# EAGLE design left_revision1_2 (EAGLE 7.2.0)
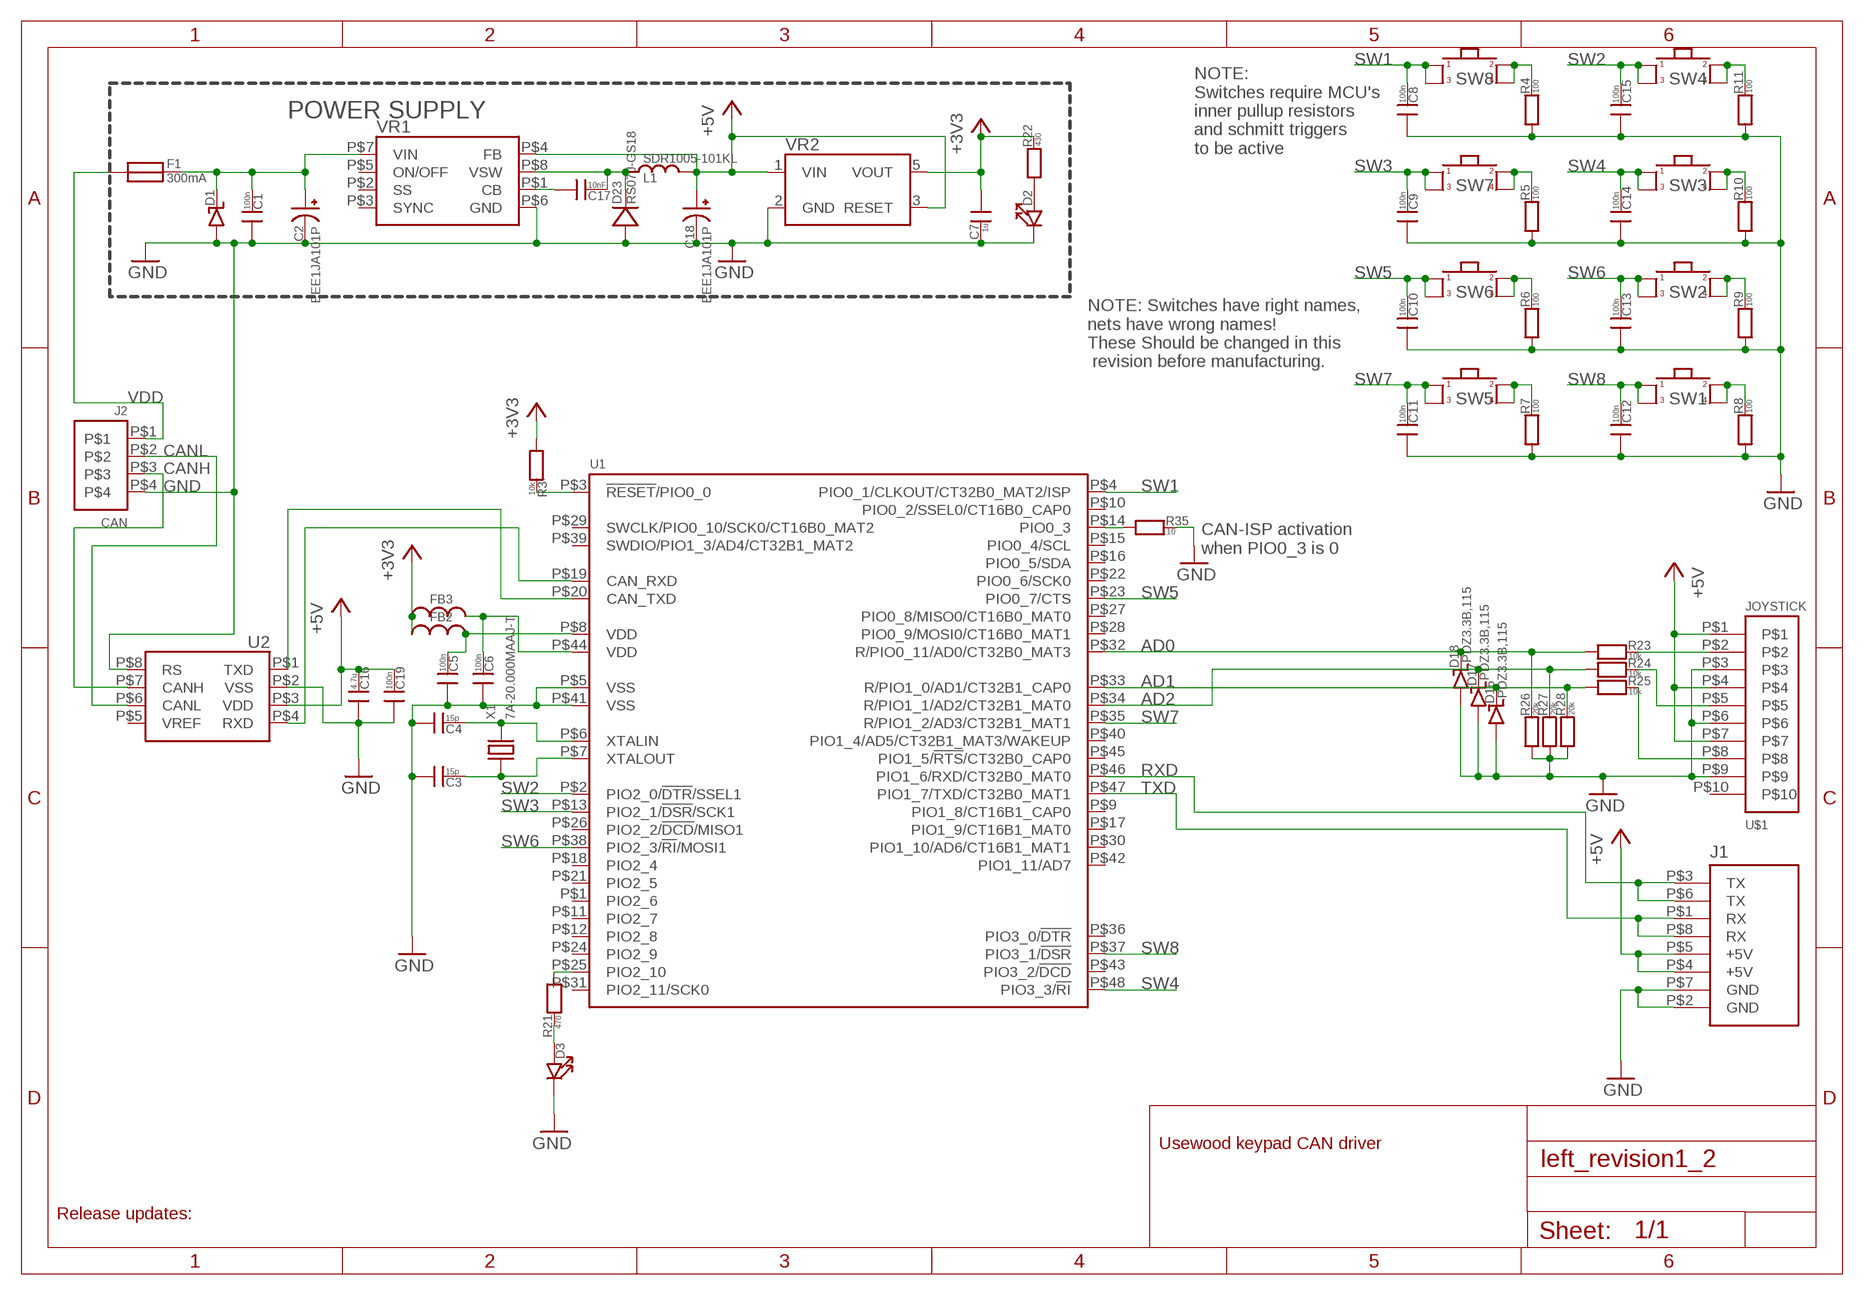
[diagram p0: schematic, sheet 1]

## Parts
C1  100n  CAP0603_SILKSCREEN  [0603_SILKSCREEN]
C2  EEE1JA101P  CAP_POLSMD_10X10X10MM  [CAP_POL_SMD_10X10X10MM]
C3  15p  CAP0603_SILKSCREEN  [0603_SILKSCREEN]
C4  15p  CAP0603_SILKSCREEN  [0603_SILKSCREEN]
C5  100n  CAP0603_SILKSCREEN  [0603_SILKSCREEN]
C6  100n  CAP0603_SILKSCREEN  [0603_SILKSCREEN]
C7  1u  CAP0603_SILKSCREEN  [0603_SILKSCREEN]
C8  100n  CAP0603_SILKSCREEN  [0603_SILKSCREEN]
C9  100n  CAP0603_SILKSCREEN  [0603_SILKSCREEN]
C10  100n  CAP0603_SILKSCREEN  [0603_SILKSCREEN]
C11  100n  CAP0603_SILKSCREEN  [0603_SILKSCREEN]
C12  100n  CAP0603_SILKSCREEN  [0603_SILKSCREEN]
C13  100n  CAP0603_SILKSCREEN  [0603_SILKSCREEN]
C14  100n  CAP0603_SILKSCREEN  [0603_SILKSCREEN]
C15  100n  CAP0603_SILKSCREEN  [0603_SILKSCREEN]
C16  4.7u  CAP0603_SILKSCREEN  [0603_SILKSCREEN]
C17  10nF  CAP0603_SILKSCREEN  [0603_SILKSCREEN]
C18  EEE1JA101P  CAP_POLSMD_10X10X10MM  [CAP_POL_SMD_10X10X10MM]
C19  100n  CAP0603_SILKSCREEN  [0603_SILKSCREEN]
D1  DIODE_TVSDO-214AA  [DO-214AB]
D2  LED0603_SILKSCREEN  [0603_SILKSCREEN]
D3  LED0603_SILKSCREEN  [0603_SILKSCREEN]
D16  PDZ3.3B,115  DIODE_ZENERSDO123  [SOD123]
D17  PDZ3.3B,115  DIODE_ZENERSDO123  [SOD123]
D18  PDZ3.3B,115  DIODE_ZENERSDO123  [SOD123]
D23  RS07J-GS18  DIODEDO219AB  [DO219AB]
F1  300mA  FUSE100MA  [FUSE_100MA]
FB2  FERRITE0603_SILKSCREEN  [0603_SILKSCREEN]
FB3  FERRITE0603_SILKSCREEN  [0603_SILKSCREEN]
J1  HEADER_USART_2_TH  [HEADER_USART_2_TH]
J2  CAN  MOLEX_MICRO-FIT_4WAYTH  [MOLEX_MICRO-FIT_4WAY]
L1  SDR1005-101KL  INDUCTORBOURNS_10X13X5MM  [INDUCTOR_BOURNS_10X13X5MM]
R3  10k  RES0604_SILKSCREEN  [0603_SILKSCREEN]
R4  100  RES0604_SILKSCREEN  [0603_SILKSCREEN]
R5  100  RES0604_SILKSCREEN  [0603_SILKSCREEN]
R6  100  RES0604_SILKSCREEN  [0603_SILKSCREEN]
R7  100  RES0604_SILKSCREEN  [0603_SILKSCREEN]
R8  100  RES0604_SILKSCREEN  [0603_SILKSCREEN]
R9  100  RES0604_SILKSCREEN  [0603_SILKSCREEN]
R10  100  RES0604_SILKSCREEN  [0603_SILKSCREEN]
R11  100  RES0604_SILKSCREEN  [0603_SILKSCREEN]
R21  470  RES0604_SILKSCREEN  [0603_SILKSCREEN]
R22  430  RES0604_SILKSCREEN  [0603_SILKSCREEN]
R23  10k  RES0604_SILKSCREEN  [0603_SILKSCREEN]
R24  10k  RES0604_SILKSCREEN  [0603_SILKSCREEN]
R25  10k  RES0604_SILKSCREEN  [0603_SILKSCREEN]
R26  20k  RES0604_SILKSCREEN  [0603_SILKSCREEN]
R27  20k  RES0604_SILKSCREEN  [0603_SILKSCREEN]
R28  20k  RES0604_SILKSCREEN  [0603_SILKSCREEN]
R35  10  RES0604_SILKSCREEN  [0603_SILKSCREEN]
SW1  SWITCH12X12MM_CENTER_HOLE  [SWITCH_12X12MM_CENTER_HOLE]
SW2  SWITCH12X12MM_CENTER_HOLE  [SWITCH_12X12MM_CENTER_HOLE]
SW3  SWITCH12X12MM_CENTER_HOLE  [SWITCH_12X12MM_CENTER_HOLE]
SW4  SWITCH12X12MM_CENTER_HOLE  [SWITCH_12X12MM_CENTER_HOLE]
SW5  SWITCH12X12MM_CENTER_HOLE  [SWITCH_12X12MM_CENTER_HOLE]
SW6  SWITCH12X12MM_CENTER_HOLE  [SWITCH_12X12MM_CENTER_HOLE]
SW7  SWITCH12X12MM_CENTER_HOLE  [SWITCH_12X12MM_CENTER_HOLE]
SW8  SWITCH12X12MM_CENTER_HOLE  [SWITCH_12X12MM_CENTER_HOLE]
U1  LPC11C14_QFP48  [QFP48]
U2  MCP2551_SOIC8  [SOIC8]
U$1  JOYSTICK  MOLEX_MICRO-FIT_10WAYTH  [MOLEX-MICRO-FIT_10WAY]
VR1  LM2671SOIC8  [SOIC8]
VR2  LP2985SOP5  [SOP5]
X1  7A-20.000MAAJ-T  XTALSMD_5X3.2  [XTAL_SMD_5X3.2]

## Nets
+3V3: C7.0 FB2.0 FB3.0 R3.0 R22.1 VR2.5(VOUT)
+5V: C16.1 C18.+ C19.1 J1.P$4(+5V) J1.P$5(+5V) L1.P$2 U2.P$3(VDD) U$1.P$1 U$1.P$4 U$1.P$7 VR1.P$4(FB) VR2.1(VIN) VR2.3(RESET)
AD0: D18.P$2(N) R23.0 R26.1 U1.P$32(R/PIO0_11/AD0/CT32B0_MAT3)
AD1: D16.P$2(N) R25.0 R28.1 U1.P$33(R/PIO1_0/AD1/CT32B1_CAP0)
AD2: D17.P$2(N) R24.0 R27.1 U1.P$34(R/PIO1_1/AD2/CT32B1_MAT0)
CAN_ISP: R35.0 U1.P$14(PIO0_3)
CANH: J2.P$3 U2.P$7(CANH)
CANL: J2.P$2 U2.P$6(CANL)
GND: C1.0 C2.- C3.0 C4.0 C5.0 C6.0 C7.1 C8.0 C9.0 C10.0 C11.0 C12.0 C13.0 C14.0 C15.0 C16.0 C18.- C19.0 D1.P$1(P) D2.1 D3.1 D16.P$1(P) D17.P$1(P) D18.P$1(P) D23.P$1(P) J1.P$2(GND) J1.P$7(GND) J2.P$4 R4.0 R5.0 R6.0 R7.0 R8.0 R9.0 R10.0 R11.0 R26.0 R27.0 R28.0 R35.1 U1.P$5(VSS) U2.P$2(VSS) U2.P$8(RS) U$1.P$3 U$1.P$6 U$1.P$9 VR1.P$6(GND) VR2.2(GND)
LED3: D3.0 R21.1
N$1: C5.1 FB2.1 U1.P$8(VDD)
N$2: R21.0 U1.P$25(PIO2_10)
N$3: D2.0 R22.0
N$4: C1.1 C2.+ D1.P$2(N) F1.P$2 VR1.P$7(VIN)
N$6: U1.P$20(CAN_TXD) U2.P$1(TXD)
N$11: C17.1 D23.P$2(N) L1.P$1 VR1.P$8(VSW)
N$12: R4.1 SW8.P$3 SW8.P$4
N$13: R5.1 SW7.P$3 SW7.P$4
N$14: R6.1 SW6.P$3 SW6.P$4
N$15: R11.1 SW4.P$3 SW4.P$4
N$16: R9.1 SW2.P$3 SW2.P$4
N$17: R10.1 SW3.P$3 SW3.P$4
N$18: R8.1 SW1.P$3 SW1.P$4
N$19: R7.1 SW5.P$3 SW5.P$4
N$20: U1.P$19(CAN_RXD) U2.P$4(RXD)
N$26: C6.1 FB3.1 U1.P$44(VDD)
N$32: C17.0 VR1.P$1(CB)
RESET: R3.1 U1.P$3(!RESET!/PIO0_0)
RXD: J1.P$3(TX) J1.P$6(TX) U1.P$46(PIO1_6/RXD/CT32B0_MAT0)
SW1: C8.1 SW8.P$1 SW8.P$2 U1.P$4(PIO0_1/CLKOUT/CT32B0_MAT2/ISP)
SW2: C15.1 SW4.P$1 SW4.P$2 U1.P$2(PIO2_0/!DTR!/SSEL1)
SW3: C9.1 SW7.P$1 SW7.P$2 U1.P$13(PIO2_1/!DSR!/SCK1)
SW4: C14.1 SW3.P$1 SW3.P$2 U1.P$48(PIO3_3/!RI)
SW5: C10.1 SW6.P$1 SW6.P$2 U1.P$23(PIO0_7/CTS)
SW6: C13.1 SW2.P$1 SW2.P$2 U1.P$38(PIO2_3/!RI!/MOSI1)
SW7: C11.1 SW5.P$1 SW5.P$2 U1.P$35(R/PIO1_2/AD3/CT32B1_MAT1)
SW8: C12.1 SW1.P$1 SW1.P$2 U1.P$37(PIO3_1/!DSR)
TXD: J1.P$1(RX) J1.P$8(RX) U1.P$47(PIO1_7/TXD/CT32B0_MAT1)
VDD: F1.P$1 J2.P$1
XJOY: R23.1 U$1.P$2
XTALIN: C4.1 U1.P$6(XTALIN) X1.P$2
XTALOUT: C3.1 U1.P$7(XTALOUT) X1.P$1
YJOY: R24.1 U$1.P$5
ZJOY: R25.1 U$1.P$8
Unconnected: U1.P$1(PIO2_6) U1.P$9(PIO1_8/CT16B1_CAP0) U1.P$10(PIO0_2/SSEL0/CT16B0_CAP0) U1.P$11(PIO2_7) U1.P$12(PIO2_8) U1.P$15(PIO0_4/SCL) U1.P$16(PIO0_5/SDA) U1.P$17(PIO1_9/CT16B1_MAT0) U1.P$18(PIO2_4) U1.P$21(PIO2_5) U1.P$22(PIO0_6/SCK0) U1.P$24(PIO2_9) U1.P$26(PIO2_2/!DCD!/MISO1) U1.P$27(PIO0_8/MISO0/CT16B0_MAT0) U1.P$28(PIO0_9/MOSI0/CT16B0_MAT1) U1.P$29(SWCLK/PIO0_10/SCK0/CT16B0_MAT2) U1.P$30(PIO1_10/AD6/CT16B1_MAT1) U1.P$31(PIO2_11/SCK0) U1.P$36(PIO3_0/!DTR) U1.P$39(SWDIO/PIO1_3/AD4/CT32B1_MAT2) U1.P$40(PIO1_4/AD5/CT32B1_MAT3/WAKEUP) U1.P$41(VSS) U1.P$42(PIO1_11/AD7) U1.P$43(PIO3_2/!DCD) U1.P$45(PIO1_5/!RTS!/CT32B0_CAP0) U2.P$5(VREF) U$1.P$10 VR1.P$2(SS) VR1.P$3(SYNC) VR1.P$5(ON/OFF)

## Notes on the sheet
- POWER SUPPLY
- NOTE:
  Switches require MCU's
  inner pullup resistors
  and schmitt triggers
  to be active
- NOTE: Switches have right names, 
  nets have wrong names! 
  These Should be changed in this
   revision before manufacturing.
- CAN-ISP activation 
  when PIO0_3 is 0
- Usewood keypad CAN driver
- Release updates:

## Library data of the parts
C1 C3-C17 C19 = usevolt:CAP
C2 C18 = usevolt:CAP_POL
D1 = arm:DIODE_TVS: 9886257 STMICROELECTRONICS SMBJ33A-TR Product Range:Transil SMBJ Series; TVS Polarity:Unidirectional; Reverse Stand-Off Voltage Vrwm:33V; Diode Case Style:DO-214AA; No. of Pins:2; Breakdown Voltage Min:36.7V; Breakdown Voltage Max:38.6 http://fi.farnell.com/webapp/wcs/stores/servlet/ProductDisplay?catalogId=15001&langId=358&urlRequestType=Base&partNumber=9886257&storeId=10159
D2 D3 = usevolt:LED
D16-D18 = usevolt:DIODE_ZENER
D23 = usevolt:DIODE
F1 = arm:FUSE: *** 100 mA *** 1861161 MULTICOMP MC36204 Holding Current:100mA; Tripping Current:300mA; Carrying Current Max:10A; Initial Resistance Max:15ohm; Operating Voltage:60VDC; PTC Fuse Case Style:SMD; Current Max:10A; External Depth:3 http://fi.farnell.com/webapp/wcs/stores/servlet/ProductDisplay?catalogId=15001&langId=358&urlRequestType=Base&partNumber=1861161&storeId=10159
FB2 FB3 = usevolt:FERRITE
J1 = usevolt:HEADER_USART_2
J2 = arm:MOLEX_MICRO-FIT_4WAY: MOLEX 43045-0401 HEADER, RIGHT ANGLE, DUAL ROW, 4 WAY, 1704306 Product Range:Micro-Fit 3.0 43045 Series; Pitch Spacing:3mm; Contact Termination Type:Through Hole; No. of Contacts:4; No. of Rows:2; Connector Mounting:PCB; Gender:Header; Contact M http://fi.farnell.com/webapp/wcs/stores/servlet/ProductDisplay?catalogId=15001&langId=358&urlRequestType=Base&partNumber=1704306&storeId=10159
L1 = usevolt:INDUCTOR
R3-R11 R21-R28 R35 = usevolt:RES
SW1-SW8 = arm:SWITCH
U1 = usevolt:LPC11C14
U2 = usevolt:MCP2551: Microchip High-Speed CAN Transceiver Supports 1 Mb/s operation • Implements ISO-11898 standard physical layer requirements • Suitable for 12V and 24V systems • Externally-controlled slope for reduced RFI emissions • Detection of ground fault (permanent dominant) on TXD input • Power-on reset and voltage brown-out protection • An unpowered node or brown-out event will not disturb the CAN bus • Low current standby operation • Protection against damage due to short-circuit conditions (positive or negative battery voltage) • Protection against high-voltage transients • Automatic thermal shutdown protection • Up to 112 nodes can be connected • High noise immunity due to differential bus implementation • Temperature ranges: - Industrial (I): -40°C to +85°C - Extended (E): -40°C to +125°C http://www.digikey.com/product-detail/en/MCP2551T-E%2FSN/MCP2551T-E%2FSNCT-ND/4307904 http://ww1.microchip.com/downloads/en/DeviceDoc/21667f.pdf http://www.farnell.com/datasheets/657417.pdf http://fi.farnell.com/microchip/mcp2551-i-sn/ic-can-transceiver-hi-speed-smd/dp/9758569
U$1 = usevolt:MOLEX_MICRO-FIT_10WAY: MOLEX HEADER, MICRO-FIT, R/A, DUAL ROW, 10 WAY, 1012255
VR1 = usevolt:LM2671: TEXAS INSTRUMENTS LM2671MX-5.0/NOPB IC, STEP-DOWN REGULATOR, SOIC-8 http://www.farnell.com/datasheets/1874686.pdf
VR2 = arm:LP2985: TEXAS INSTRUMENTS LP2985IM5-3.3 V REG LDO +3.3V, SMD, 2985, SOT235 http://www.farnell.com/datasheets/1882537.pdf
X1 = arm:XTAL

## Board
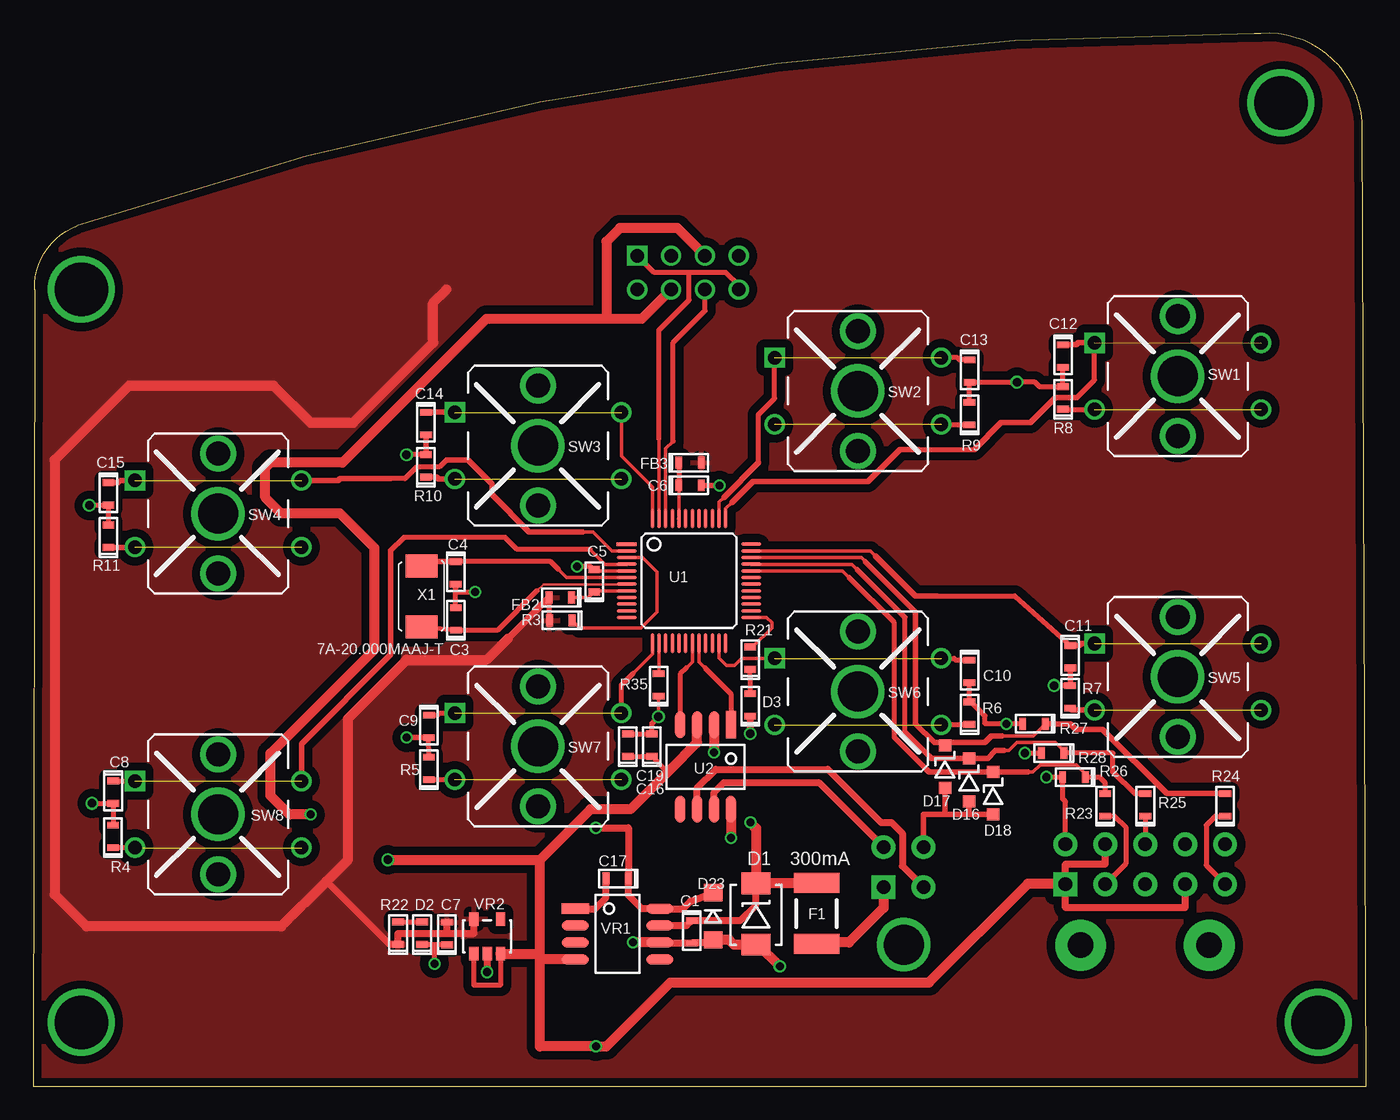
[diagram p1: board, top side]
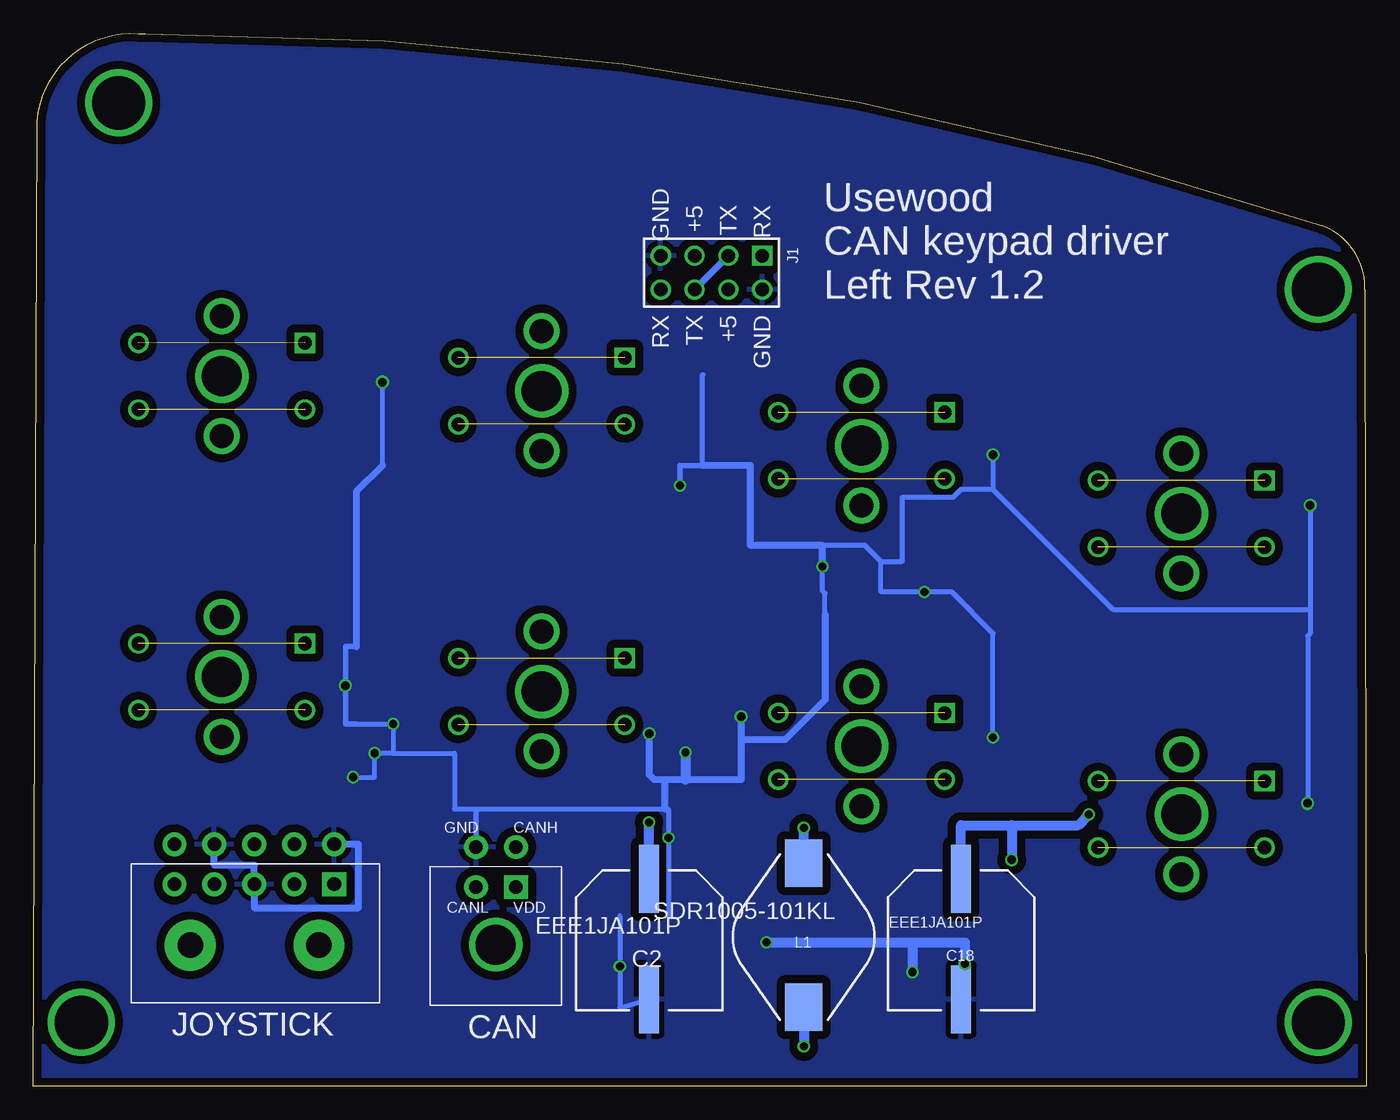
[diagram p2: board, bottom side, seen from below]

Size 100 x 79.02 mm. Coordinates in mm from the lower left corner, seen from the top.
Outline: 100,0 99.7,72.4 arc90 92.1,79 91.6,79 arc19 3.3,64.6 arc71 0.1,59.8 0,0 100,0
Copper layers (1*16): Top 0.035mm / dielectric 1.5mm / Bottom 0.035mm
Design rules "SeeedStudio_2layer_DRU_no_angle_20140221 *": minimum track width 6mil, minimum drill 12mil, track to track 6mil, track to pad 6mil, pad to pad 6mil, via to via 6mil, smd to smd 0mil, copper to edge 10mil, drill to drill 10mil, minimum pad ring 10mil, minimum via ring 6mil, stop-mask expansion 2mil, vias tented up to drill 100mil, thermal gap 16mil

### Footprints (pad centres in the part's own frame; a part is rotated, then mirrored left to right if it is on the bottom)
0603_SILKSCREEN = smd 0.508 x 0.889: 0 -1.041,0; 1 0.648,0
CAP_POL_SMD_10X10X10MM = smd 1.5 x 5.08: + 0,0.635; - 0,9.665
DO-214AB = smd 1.62 x 2.18: P$1 0,0; P$2 4.6,0
SOD123 = smd 0.9 x 0.95: P$1 0,0; P$2 3.2,0
DO219AB = smd 1.3 x 1.4: P$1 0,0; P$2 3.535,0
FUSE_100MA = smd 1.5 x 3.41: P$1 0,0; P$2 4.572,0
HEADER_USART_2_TH = drill 1.016 square: P$1 1.27,8.89 | drill 1.016: P$2 3.81,8.89; P$3 1.27,6.35; P$4 3.81,6.35; P$5 1.27,3.81; P$6 3.81,3.81; P$7 1.27,1.27; P$8 3.81,1.27
MOLEX_MICRO-FIT_4WAY = drill 1.016 pad 1.778 square: P$1 1.27,2.032 | drill 1.016 pad 1.778: P$2 -1.727,2.032; P$3 1.27,5.029; P$4 -1.727,5.029 | drill 3: P$5 -0.25,-2.3
INDUCTOR_BOURNS_10X13X5MM = smd 3.556 x 2.8: P$1 -1.754,0; P$2 9.054,0
SWITCH_12X12MM_CENTER_HOLE = drill 1.016 square: P$1 -3,4.75 | drill 1.016: P$2 9.5,4.75; P$3 -3,-0.25; P$4 9.5,-0.25 | drill 3 pad 2.9: P$5 3.25,2.25 | drill 1.8 pad 1.7: P$10 3.25,6.75; P$11 3.25,-2.25
QFP48 = smd 1.5 x 0.28: P$1 0.2,0; P$2 0.2,-0.5; P$3 0.2,-1; P$4 0.2,-1.5; P$5 0.2,-2; P$6 0.2,-2.5; P$7 0.2,-3; P$8 0.2,-3.5; P$9 0.2,-4; P$10 0.2,-4.5; P$11 0.2,-5; P$12 0.2,-5.5; P$25 9.55,-5.5; P$26 9.55,-5; P$27 9.55,-4.5; P$28 9.55,-4; P$29 9.55,-3.5; P$30 9.55,-3; P$31 9.55,-2.5; P$32 9.55,-2; P$33 9.55,-1.5; P$34 9.55,-1; P$35 9.55,-0.5; P$36 9.55,0 | smd 0.28 x 1.5: P$13 2.125,-7.425; P$14 2.625,-7.425; P$15 3.125,-7.425; P$16 3.625,-7.425; P$17 4.125,-7.425; P$18 4.625,-7.425; P$19 5.125,-7.425; P$20 5.625,-7.425; P$21 6.125,-7.425; P$22 6.625,-7.425; P$23 7.125,-7.425; P$24 7.625,-7.425; P$37 7.625,1.925; P$38 7.125,1.925; P$39 6.625,1.925; P$40 6.125,1.925; P$41 5.625,1.925; P$42 5.125,1.925; P$43 4.625,1.925; P$44 4.125,1.925; P$45 3.625,1.925; P$46 3.125,1.925; P$47 2.625,1.925; P$48 2.125,1.925
SOIC8 = smd 2.032 x 0.762: P$1 -2.54,2.54; P$2 -2.54,1.27; P$3 -2.54,0; P$4 -2.54,-1.27; P$5 3.81,-1.27; P$6 3.81,0; P$7 3.81,1.27; P$8 3.81,2.54
MOLEX-MICRO-FIT_10WAY = drill 1.016 pad 1.778 square: P$1 0,-0.508 | drill 1.016 pad 1.778: P$2 -2.997,-0.508; P$3 -5.994,-0.508; P$4 -8.992,-0.508; P$5 -11.989,-0.508; P$6 0,2.489; P$7 -2.997,2.489; P$8 -5.994,2.489; P$9 -8.992,2.489; P$10 -11.989,2.489 | drill 1.905 pad 3.81: P$11 -10.795,-5.08; P$12 -1.143,-5.08
SOP5 = smd 0.7 x 1: 1 -1,0; 2 0,0; 3 1,0; 4 1,2.6; 5 -1,2.6
XTAL_SMD_5X3.2 = smd 1.7 x 2.4: P$1 -2.286,0; P$2 2.286,0

### Placement (x,y rotation side)
C1  49.4,11.8 90 top
C2  53.8,16.2 180 bottom
C3  31.7,34.87 270 top
C4  31.69,38.73 90 top
C5  42.09,37.75 270 top
C6  49.07,45.1 180 top
C7  31.04,11.28 270 top
C8  6,22.27 90 top
C9  29.67,27.21 90 top
C10  70.24,31.33 90 top
C11  77.8,32.43 90 top
C12  77.25,54.99 90 top
C13  70.25,53.87 90 top
C14  29.46,49.93 90 top
C15  5.63,44.65 90 top
C16  46.4,25.4 270 top
C17  44,15.6 0 top
C18  30.4,16.2 180 bottom
C19  44.6,25.4 270 top
D1  54.22,10.64 90 top
D2  29.17,11.3 270 top
D3  53.79,28.43 270 top
D16  70.2,21.4 90 top
D17  68.4,22.4 90 top
D18  72,20.4 90 top
D23  51,11 90 top
F1  58.77,10.69 90 top
FB2  39.73,36.68 0 top
FB3  49.08,46.8 180 top
J1  54.2,63.6 270 bottom
J2  65.06,12.93 0 bottom
L1  42.2,15 270 bottom
R3  39.77,34.97 0 top
R4  5.97,18.57 270 top
R5  29.68,23.67 270 top
R6  70.24,27.81 270 top
R7  77.79,29.03 270 top
R8  77.26,51.47 270 top
R9  70.24,50.29 270 top
R10  29.45,46.37 270 top
R11  5.63,41.09 270 top
R21  53.78,31.93 270 top
R22  27.37,11.3 270 top
R23  80.42,20.93 270 top
R24  89.42,20.93 270 top
R25  83.43,20.93 270 top
R26  78.27,23.2 0 top
R27  75.27,27.2 0 top
R28  76.67,25.01 0 top
R35  46.92,29.93 270 top
SW1  82.61,51.04 0 top
SW2  58.61,49.93 0 top
SW3  34.61,45.82 0 top
SW4  10.61,40.72 0 top
SW5  82.61,28.49 0 top
SW6  58.61,27.38 0 top
SW7  34.61,23.27 0 top
SW8  10.61,18.16 0 top
U1  44.32,40.68 0 top
U2  49.8,24.6 270 top
U$1  77.43,15.67 0 bottom
VR1  43.2,10.8 0 top
VR2  34.05,9.96 0 top
X1  29.12,36.76 90 top

### Tracks (layer width: path | path; a pad name or v marks a point on that pad's centre or on a via)
+3V3
  Top 0.381: FB2.0 38.69,35.03 R3.0
  Top 0.508: 33,12.56 VR2.5 33.05,11.48 31,11.48 | 35.6,33.6 FB2.0 | 22,15.4 26.75,10.65 R22.1 27.37,11.48 31,11.48 | C7.0 31,12.32 31,11.48 | 50.12,46.88 FB3.0
  Top 0.762: 35.6,33.6 34,32 28,32 23.6,27.6 23.6,17 22,15.4 18.6,12 4,12 1.6,14.4 1.6,47 7.2,52.6 18,52.6 20.8,49.8 24,49.8 30,55.8 30,58.8 31,59.8
  pour Top (isolate 0.61): 0,0 0.2,59.8 arc-41 0.8,62.2 arc-28 2.6,64.2 arc-9 11.4,67.2 arc1 28.4,71.6 arc-5 45.2,75.2 arc-6 73.2,78.4 arc-3 90,79 arc-1 92.4,79 arc-15 93.8,78.8 arc-5 96.2,78 arc-27 98.2,76 arc-39 99.6,72.4 100,0
+5V  (via drill 0.6, 0.64)
  Top 0.381: VR2.3 35.05,7.6 33.05,7.6 VR2.1 | U$1.P$4 86.4,15.17 | C19.1 C16.1 47.35,23.8 47.8,23.8 | 44.8,20.8 44.8,20.6
  Top 0.508: VR2.3 35.05,10 | U$1.P$7 80.43,16.68 77.43,16.68 U$1.P$1 77.43,13.4 86.4,13.4 86.4,15.17 | 37.93,9.6 38,9.53
  Top 0.762: v26.6,17 38,17 | U$1.P$1 77.4,15.2 74.6,15.2 67.2,7.8 47.8,7.8 43,3 v42.2,3 38,3 38,9.53 | 38,9.53 38,9.96 | 38,9.96 38,17 | VR1.P$4 38,9.53 | 38,17 41.8,20.8 44.8,20.8 47.8,23.8 49.8,25.8 U2.P$3 | VR2.3 38,9.96 | v20.8,20.4 19.2,20.4 17.8,21.8 17.8,25 25.6,32.8 25.6,40.4 23,43 18.6,43 17.4,44.2 17.4,46.4 17.8,46.8 23.2,46.8 34,57.6 43,57.6 | 43,57.6 45.66,57.6 J1.P$4 | J1.P$5 48.32,64.4 44,64.4 43,63.4 43,57.6
  Bottom 0.762: L1.P$2 v42.2,3 | C18.+ 30.4,19.6 26.6,19.6 | 26.6,19.6 v26.6,17 | 26.6,19.6 21.6,19.6 v20.8,20.4
AD0
  Top 0.254: R26.1 79.07,23.31 78.24,24.14 75.54,24.14 75,23.6 74.6,23.6 | 61.2,38.2 60.72,38.68 U1.P$32
  Top 0.381: R23.0 80.42,22.78 80,23.2 79.08,23.2 R26.1 | 67,23.8 64.6,26.2 64.6,34.8 61.2,38.2
  Top 0.406: 67,23.8 67.2,23.6 D18.P$2 74.6,23.6
AD1
  Top 0.254: 61.8,38.8 61.42,39.18 U1.P$33 | R28.1 77.32,25.16 76.68,25.8 73.8,25.8 73.2,25.2 72.8,25.2
  Top 0.381: 81,23.6 81,25.01 R28.1 | 67.2,24.8 65.4,26.6 65.4,35.2 61.8,38.8
  Top 0.406: 72.8,25.2 72.2,25.2 71.6,24.6 D16.P$2 67.4,24.6 67.2,24.8 | 81,23.6 82.63,21.97 R25.0
AD2
  Top 0.254: 62.4,39.4 62.3,39.5 62.12,39.68 U1.P$34 | R27.1 75.02,26.3 72.68,26.3 | D17.P$2 68.4,25.8
  Top 0.381: 66.2,35.6 62.4,39.4
  Top 0.406: R27.1 77.8,27.2 78.2,26.8 80.2,26.8 85.03,21.97 R24.0 | 66.2,35.6 66.2,27.2 67.6,25.8 68.4,25.8 71.4,25.8 71.9,26.3 72.68,26.3
CAN_ISP
  Top 0.254: R35.0 46.95,30.99 U1.P$14
CANH
  Top 0.508: U2.P$7 51.07,22.07 51.8,22.8 58.94,22.8 J2.P$3
CANL
  Top 0.508: U2.P$6 49.8,22.4 51.2,23.8 59.6,23.8 63.6,19.8 64.4,19.8 65.2,19 65.2,16.54 J2.P$2
GND  (via drill 0.6, 0.61, 0.64)
  Top 0.254: 42.33,38.68 C5.0 42.2,38.68 U1.P$5 | v46.9,27.74 46.9,29.13 R35.1
  Top 0.381: C5.0 41.81,38.99 v40.8,39 | R4.0 6,19.79 C8.0 5.99,21.24 v4.4,21.24 | R11.0 C15.0 4.2,43.61 v4.2,43.6 | R5.0 29.66,26.16 C9.0 | R9.0 C13.0 | C13.0 | C12.0 R8.0 75.49,52.51 75.16,52.84 v73.8,52.84 v73.8,52.83 C13.0 | 70.24,28.96 C10.0 | U$1.P$6 77.43,21.37 77.23,21.57 R26.0 v76,23.2 | R28.0 v74.4,25 | R27.0 v73,27.2 71.4,27.2 71.4,27.8 70.24,28.96 | R10.0 v28,47.41 v28,47.4 | 70.24,28.96 R6.0 | C7.1 30,10.63 | 30,10.63 29.19,10.63 D2.1 | v30.1,9.2 30.1,10.53 30,10.63 | C3.0 31.69,35.92 C4.0 31.69,37.1 v33.14,37.1 | v46.9,27.74 46.4,27.24 C16.0 C19.0 | 52.34,18.68 v52.34,18.66
  Top 0.406: R10.0 C14.0 | C6.0 v51.48,45.1 | C11.0 R7.0 76.58,30.07 v76.58,30.08 | D18.P$1 70.2,20.4 | 70.2,20.4 68.4,20.4 | 68.4,20.4 66.78,20.4 J2.P$4 | D16.P$1 70.2,20.4 | D17.P$1 68.4,20.4 | v28,26.17 C9.0
  Top 0.508: VR2.2 34.05,8.6 v34.04,8.58 | D3.1 53.78,27.62 v53.78,26.46 | D23.P$1 50.76,10.76 C1.0 47.05,10.76 VR1.P$6
  Top 0.762: D23.P$1 52.2,11 52.56,10.64 D1.P$1 54.36,10.64 v56,9 | VR1.P$6 v45,10.8 | U2.P$2 v51.08,25.06 | U2.P$8 52.34,18.68
  Bottom 0.381: v34.04,8.58 34.04,8.6 | 73,25 v73,27.2 75.78,27.2 | 73,25 v74.4,25 74.4,23.2 v76,23.2 | v4.4,21.24 4.4,33.8 4.2,34 4.2,35.8 | v4.2,43.6 4.2,35.8 | v28,26.17 28,34 31.1,37.1 v33.14,37.1 36.4,37.1 36.4,39.4 | 49.8,46.6 49.8,53.4 49.74,53.4 | 73,25 68.4,25 68.4,20.8 66.8,20.8 52.6,20.8 52.36,20.8 v52.34,18.66 52.36,12.8 | 75.78,34.2 75.78,33 | 73.8,46.6 v73.8,52.84 | 40.6,35.4 40.6,37 40.8,37.2 v40.8,39 | v28,47.4 28,44.8 | 36.4,39.4 34.8,39.4 34.8,44.2 31,44.2 30.4,44.8 28,44.8 | 36.4,39.4 37.6,40.6 40.8,40.6 | C2.- 56,5.9 v56,9 56,12.8 | 28,44.8 19,35.8 4.2,35.8
  Bottom 0.406: v51.48,45.1 51.48,46.6 49.8,46.6 | 75.78,27.2 76.58,27.2 v76.58,30.08 76.58,33 75.78,33 | 66.8,20.8 66.8,18 66.78,18 J2.P$4
  Bottom 0.508: U$1.P$9 86.42,16.6 83.4,16.6 83.43,16.57 U$1.P$3 83.43,13.4 75.6,13.4 75.6,18.16 U$1.P$6 | v46.9,27.74 46.9,26 | 46.9,26 46.9,23 51.08,23 52.6,23 | 52.6,23 53.4,23 53.78,23.38 v53.78,26.46 | v40.8,39 40.8,40.6 46.2,40.6 46.2,46.6 49.8,46.6 | 73.8,46.6 75.78,44.62 75.78,33 | 40.6,35.4 40.6,29 43.6,26 46.9,26 | 52.6,20.8 52.6,23
  Bottom 0.762: C18.- 30.1,5.9 v30.1,9.2 30.1,10.8 34.04,10.8 | v45,10.8 34.04,10.8 | 34.04,10.8 v34.04,8.58 | v51.08,25.06 51.08,23
  pour Bottom (isolate 0.61): 0,0 0.2,60 arc-41 0.8,62.2 arc-28 2.6,64.2 arc-9 11.4,67.2 arc1 28.4,71.6 arc-5 45.2,75.2 arc-6 73.2,78.4 arc-3 90,79 arc-1 92.4,79 arc-15 93.8,78.8 arc-5 96.2,78 arc-27 98.2,76 arc-39 99.6,72.4 100,0
LED3
  Top 0.381: D3.0 53.79,30.52 R21.1
N$1
  Top 0.254: U1.P$8 42.17,37.18 C5.1 41.67,36.68 FB2.1
N$2
  Top 0.254: R21.0 53.97,32.97 55.4,34.4 55.4,34.8 55,35.2 53.89,35.2 U1.P$25
N$3
  Top 0.381: R22.0 D2.0
N$4  (via drill 0.6)
  Top 0.508: D1.P$2 54.2,15.21 54.2,13.6 53.05,12.45 C1.1 49.02,12.07 VR1.P$7
  Top 0.762: F1.P$2 58.74,15.24 D1.P$2 54.22,19.38 v53.8,19.8
  Bottom 0.762: C2.+ v53.8,19.8
N$6
  Top 0.254: U1.P$20 49.95,31.86 50.4,31.4
  Top 0.381: 50.4,31.4 52.34,29.46 U2.P$1
N$7  (via drill 4)
  other vias: 96.4,4.8
N$8  (via drill 4)
  other vias: 3.6,4.8
N$9  (via drill 4)
  other vias: 3.6,59.8
N$10  (via drill 4)
  other vias: 93.6,73.8
N$11  (via drill 0.6)
  Top 0.508: D23.P$2 49.3,13.9 48.74,13.34 VR1.P$8 45.66,13.34 44.65,14.35 C17.1 44.65,19.4 v42.2,19.4
  Bottom 0.762: L1.P$1 v42.2,19.4
N$12  (1 unrouted)
  Top 0.381: SW8.P$3 8.2,17.91 8.19,17.92 R4.1
N$13  (1 unrouted)
  Top 0.381: R5.1 SW7.P$3
N$14  (1 unrouted)
  Top 0.381: R6.1 70.21,27.13 SW6.P$4
N$15  (1 unrouted)
  Top 0.406: R11.1 7.59,40.44 SW4.P$3
N$16  (1 unrouted)
  Top 0.381: R9.1 68.16,49.64 SW2.P$4
N$17  (1 unrouted)
  Top 0.406: R10.1 30.26,45.72 30.41,45.57 SW3.P$3
N$18  (1 unrouted)
  Top 0.381: R8.1 77.28,50.79 SW1.P$3
N$19  (1 unrouted)
  Top 0.406: R7.1 77.93,28.24 SW5.P$3
N$20
  Top 0.254: U1.P$19 49.45,31.85 49,31.4
  Top 0.381: 49,31.4 48.53,30.93 U2.P$4
N$26
  Top 0.254: 48.42,42.63 U1.P$44 48.45,45.08 C6.1
  Top 0.381: FB3.1 48.43,45.11 C6.1
N$32
  Top 0.508: VR1.P$1 42.14,13.34 42.96,14.16 C17.0
RESET
  Top 0.254: R3.1 40.99,34.4 45.6,34.4 46.8,35.6 46.8,38.6 45.72,39.68 U1.P$3
RXD
  Top 0.254: U1.P$46 47.45,47.84 48,48.4
  Top 0.381: 48,48.4 48,55.8 50.4,58.2 J1.P$6
  Bottom 0.508: J1.P$3 J1.P$6
SW1  (1 unrouted)
  Top 0.254: 41.78,40.3 42.9,39.18 U1.P$4
  Top 0.381: 27.8,41.2 35.4,41.2 36.3,40.3 41.78,40.3 | C8.1 7.6,22.92 SW8.P$1
  Top 0.406: SW8.P$2 20.11,25.71 26.8,32.4 26.8,40.2 27.8,41.2
SW2  (1 unrouted)
  Top 0.254: 41.2,41.6 42,41.6 43.42,40.18 U1.P$2
  Top 0.381: 31,47 30.48,46.48 28.76,46.48 27.88,45.6 26.8,45.6
  Top 0.406: C15.1 6.38,45.3 6.55,45.47 SW4.P$1 | 41.2,41.6 37.2,41.6 34.4,44.4 34.4,45.2 32.6,47 31,47 | 26.8,45.6 23,45.6 22.87,45.47 SW4.P$2
SW3  (1 unrouted)
  Top 0.254: 45,31 46.45,32.45 U1.P$13
  Top 0.381: C9.1 30.34,27.86 30.5,28.02 SW7.P$1 | SW7.P$2 44.11,30.11 45,31
SW4  (1 unrouted)
  Top 0.254: SW3.P$2 44.11,47.29 46.45,44.95 U1.P$48
  Top 0.406: C14.1 31.61,50.58 SW3.P$1
SW5  (1 unrouted)
  Top 0.254: SW6.P$1 53.13,32.13 52.6,31.6 52,31.6 51.45,32.15 U1.P$23
  Top 0.381: SW6.P$2 69.07,32.13 69.22,31.98 C10.1
SW6  (1 unrouted)
  Top 0.254: 51.8,44.2 51.44,43.84 51.44,42.61 U1.P$38
  Top 0.381: 54.4,46.8 54.4,50.4 55.61,51.61 SW2.P$1 | C13.1 69.48,54.52 69.32,54.68 SW2.P$2
  Top 0.406: 54.4,46.8 51.8,44.2
SW7  (1 unrouted)
  Top 0.254: 63.2,39.8 62.82,40.18 U1.P$35
  Top 0.381: 67.8,36.8 73.63,36.8 C11.1
  Top 0.406: C11.1 78.48,33.08 78.64,33.24 SW5.P$1 | 67.8,36.8 66.2,36.8 63.2,39.8
SW8  (1 unrouted)
  Top 0.254: 51.94,42.61 U1.P$37 51.95,43.34 52.4,43.8
  Top 0.381: SW1.P$1 79.61,53.01 78.28,51.68 | 66.4,47.8 70.6,47.8
  Top 0.406: C12.1 78.24,55.64 78.4,55.8 SW1.P$1 | 66.4,47.8 65,47.8 62.6,45.4 54,45.4 52.4,43.8 | 70.6,47.8 72.6,49.8 74.8,49.8 76.68,51.68 78.28,51.68
TXD
  Top 0.254: 46.94,42.61 U1.P$47 46.95,48.57 46.94,48.58
  Top 0.381: 46.94,48.58 46.94,56.74 49.2,59 49.2,61.06 | 49.2,61.06 46.58,61.06 J1.P$1 | J1.P$8 52.93,60.07 51.94,61.06 49.2,61.06
VDD
  Top 0.762: J2.P$1 63.79,13.39 61.2,10.8 59.4,10.8 59.29,10.69 F1.P$1
XJOY
  Top 0.381: U$1.P$2 82,16.74 82,19.4 81.12,20.28 R23.1
XTALIN
  Top 0.254: U1.P$6 40.02,38.18 39.4,38.8
  Top 0.381: 39.4,38.8 38.82,39.38 C4.1
  Top 0.406: C4.1 29.19,39.38 X1.P$2
XTALOUT
  Top 0.203: 37.8,37.2 38.28,37.68 U1.P$7
  Top 0.381: 37.8,37.2 34.82,34.22 C3.1 X1.P$1
YJOY
  Top 0.381: U$1.P$5 88,16.59 88,19.6 88.68,20.28 R24.1
ZJOY
  Top 0.381: R25.1 83.43,20.12 U$1.P$8

### Text on the board
bPlace: Usewood / CAN keypad driver / Left Rev 1.2 | CANH | GND | VDD | CANL | CAN | JOYSTICK